# EAGLE schematic experimental (EAGLE 7.7.0)
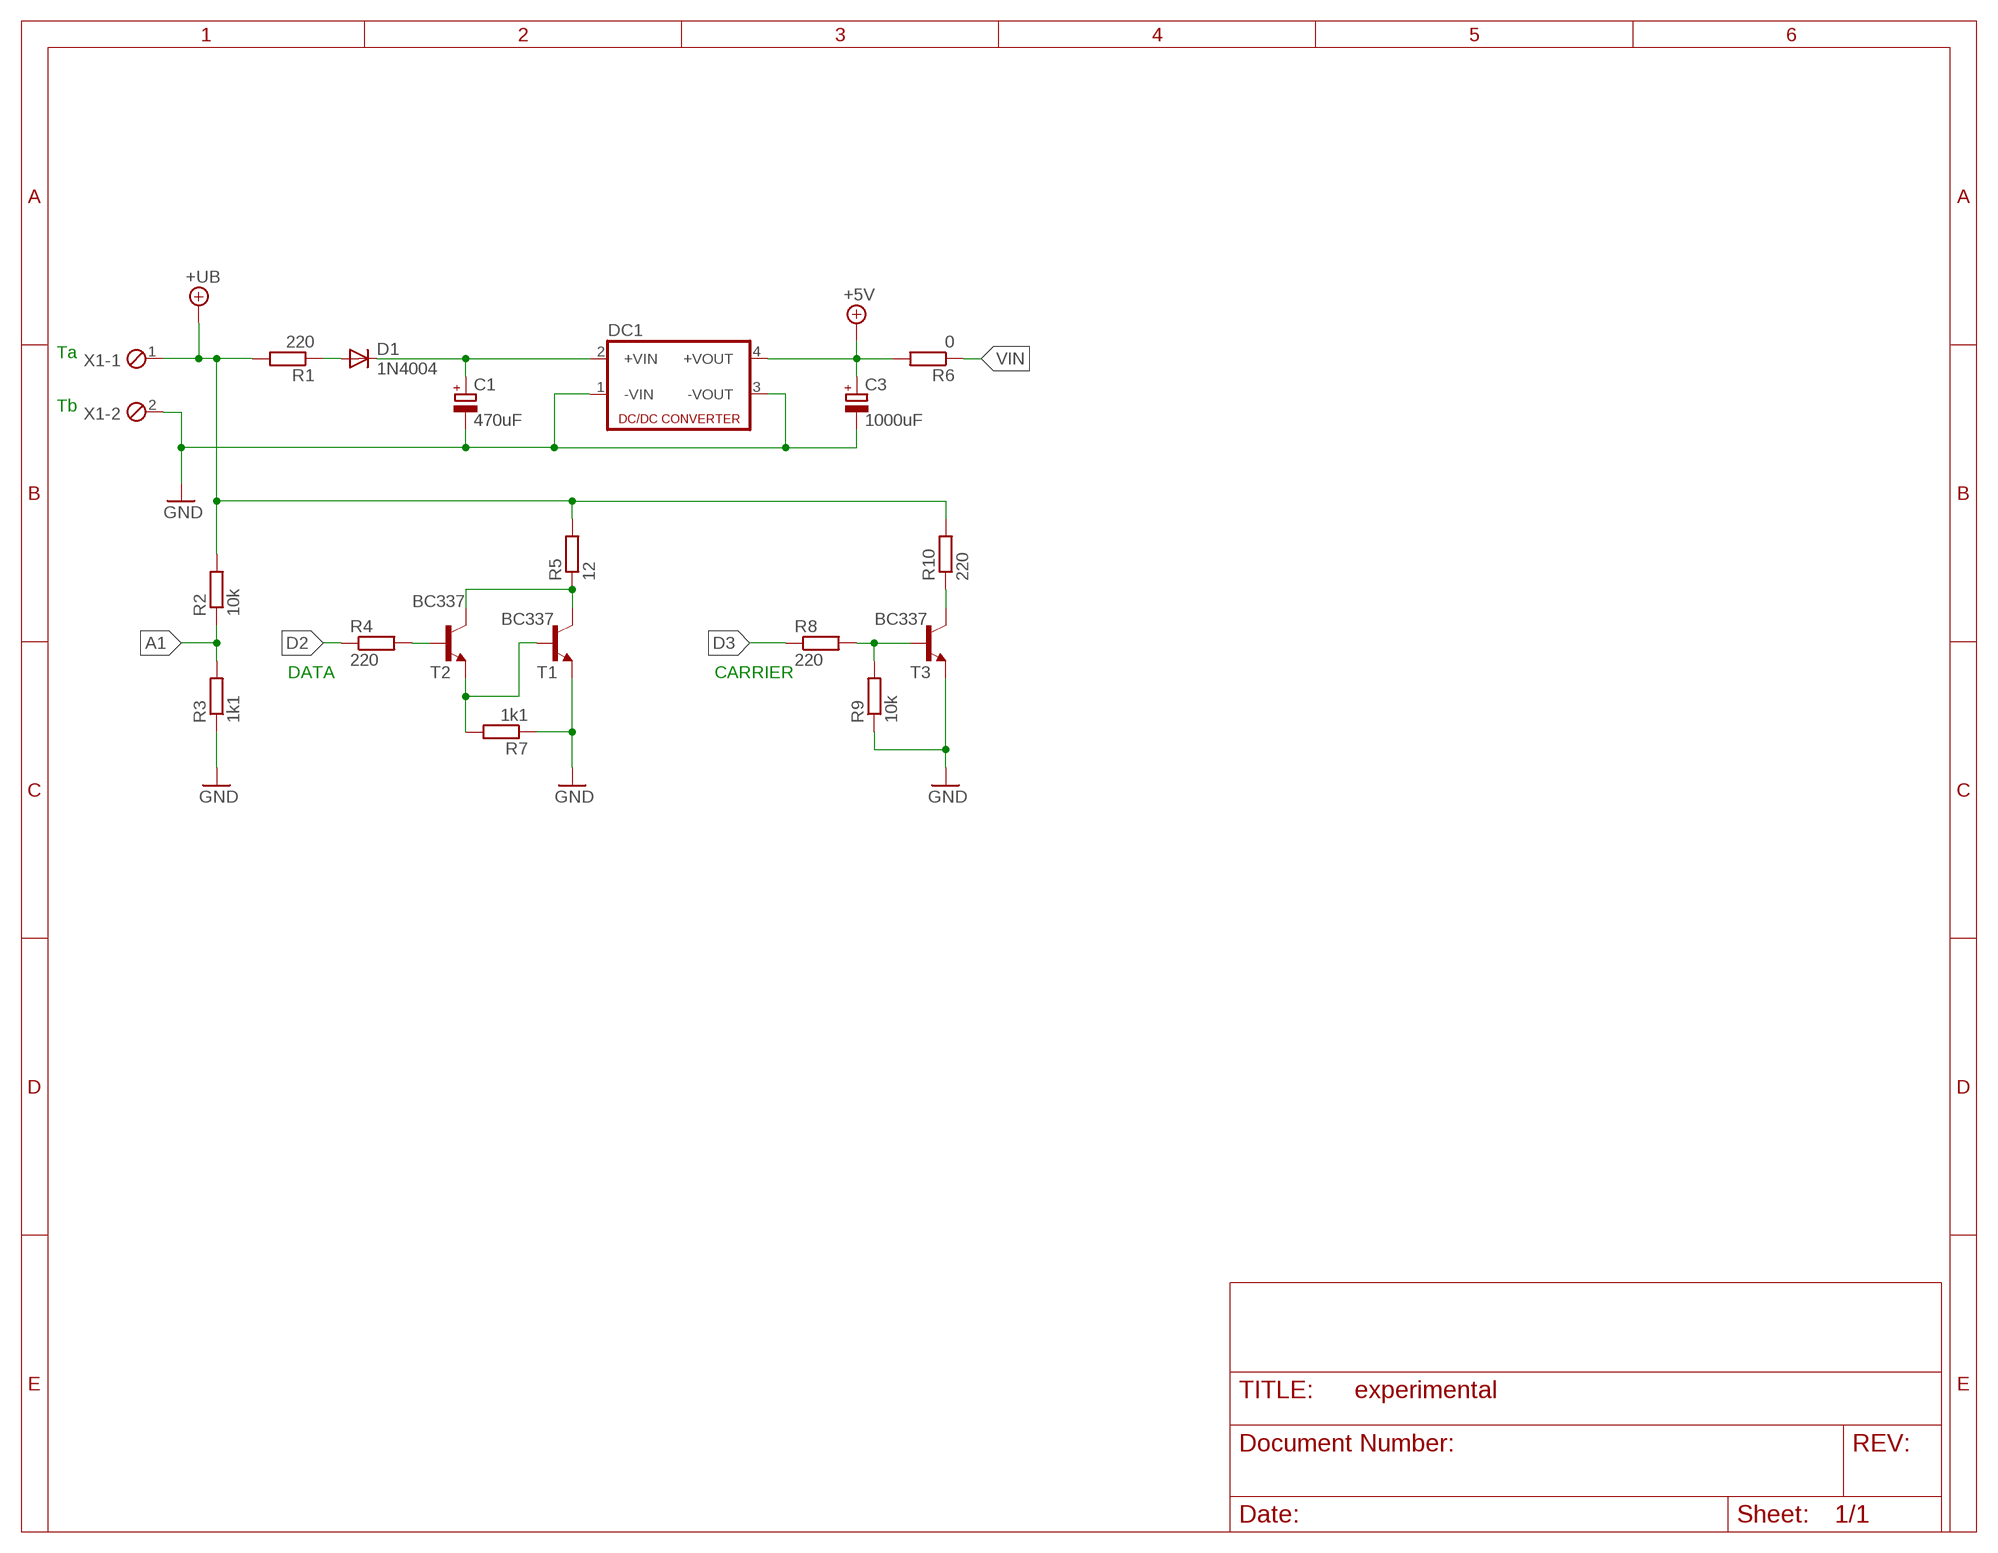
[diagram p0: schematic, sheet 1]

## Parts
C1  470uF  CPOL-EUE10-20  [EB20D]
C3  1000uF  CPOL-EUE10-20  [EB20D]
D1  1N4004  [DO41-10]
DC1  NME  [NME]
R1  220  R-EU_0204/7  [0204/7]
R2  10k  R-EU_0204/7  [0204/7]
R3  1k1  R-EU_0204/7  [0204/7]
R4  220  R-EU_0204/7  [0204/7]
R5  12  R-EU_0204/7  [0204/7]
R6  0  R-EU_0204/7  [0204/7]
R7  1k1  R-EU_0204/7  [0204/7]
R8  220  R-EU_0204/7  [0204/7]
R9  10k  R-EU_0204/7  [0204/7]
R10  220  R-EU_0204/7  [0204/7]
T1  BC337  [TO92]
T2  BC337  [TO92]
T3  BC337  [TO92]
X1  MPT2  [2POL254]

## Nets
+5V: C3.+ DC1.4(+VOUT) R6.2
+UB: R1.2 R2.2 R5.2 R10.2 X1.1
A1: R2.1 R3.2
D2: R4.1
D3: R8.1
GND: C1.- C3.- DC1.1(-VIN) DC1.3(-VOUT) R3.1 R7.1 R9.1 T1.1(E) T3.1(E) X1.2
N$1: C1.+ D1.C DC1.2(+VIN)
N$2: D1.A R1.1
N$3: R4.2 T2.2(B)
N$4: R5.1 T1.3(C) T2.3(C)
N$5: R7.2 T1.2(B) T2.1(E)
N$6: R8.2 R9.2 T3.2(B)
N$7: R10.1 T3.3(C)
VIN: R6.1

## Notes on the sheet
- Ta
- Tb
- DATA | CARRIER

## Library data of the parts
C1 C3 = rcl:CPOL-EU: POLARIZED CAPACITOR, European symbol
D1 = diode:1N4004: DIODE general purpose rectifier, 1 A
DC1 = dc-dc-converter:NME: DC-DC CONVERTER; MF: C & D TECHNOLOGIES, INC; MPN: NME1205D; OC_FARNELL: 1021466; OC_NEWARK: 98B8198
R1-R10 = rcl:R-EU_: RESISTOR, European symbol
T1-T3 = transistor:BC337: NPN TRANSISTOR
X1 = con-phoenix-254:MPT2: PHOENIX CONNECTOR; OC_FARNELL: unknown; OC_NEWARK: unknown